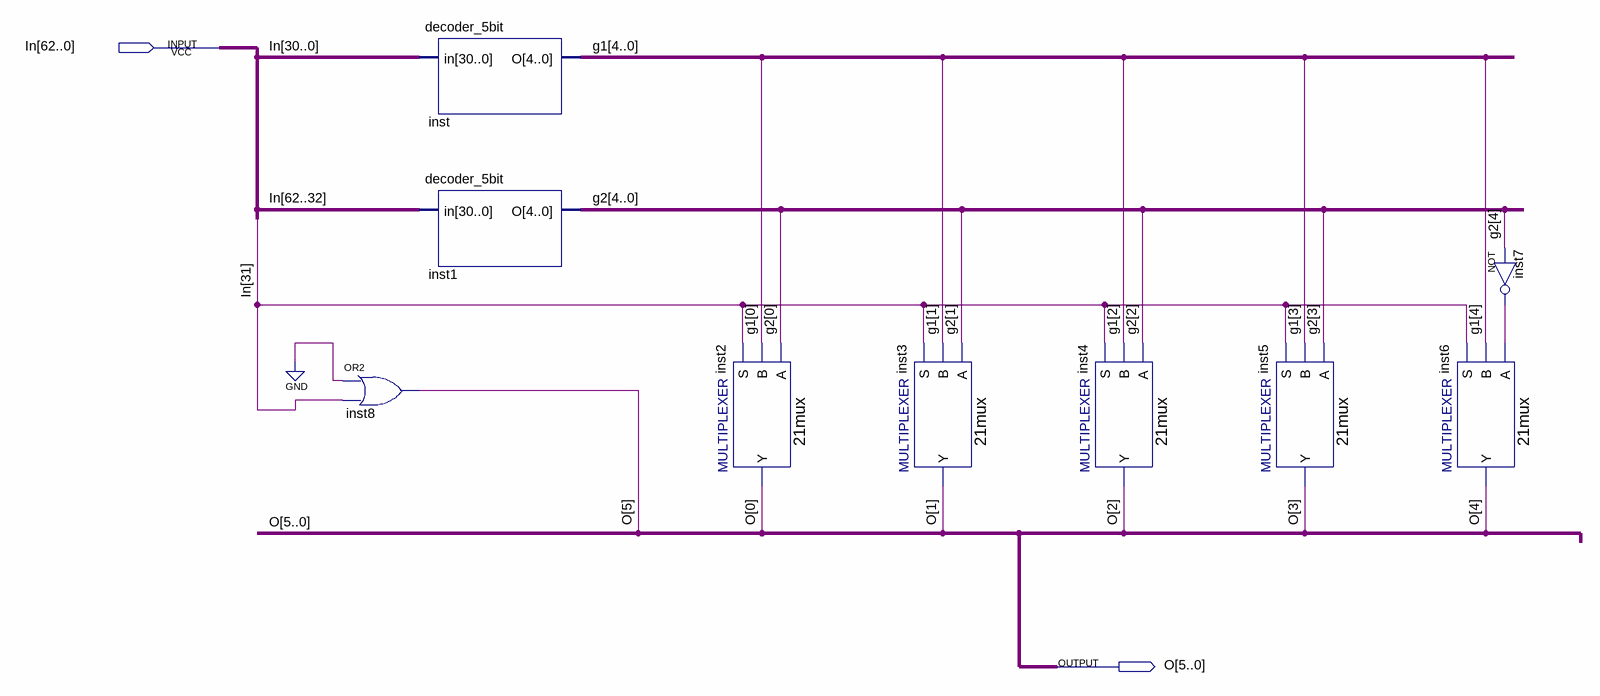
[diagram p0: schematic sheet]
// Quartus schematic decoder_6bit.bdf as structural Verilog: 9 symbols, 2 pins
module decoder_6bit (
  input  [62:0] In,
  output [5:0] O
);

  wire inst7_out;
  wire [4:0] g1, g2;

  or inst8 (O[5], 1'b0, In[31]);
  decoder_5bit inst (.in(In[30:0]), .O(g1));
  decoder_5bit inst1 (.in(In[62:32]), .O(g2));
  \21mux  inst2 (.S(In[31]), .B(g1[0]), .A(g2[0]), .Y(O[0]));
  \21mux  inst3 (.S(In[31]), .B(g1[1]), .A(g2[1]), .Y(O[1]));
  \21mux  inst4 (.S(In[31]), .B(g1[2]), .A(g2[2]), .Y(O[2]));
  \21mux  inst5 (.S(In[31]), .B(g1[3]), .A(g2[3]), .Y(O[3]));
  \21mux  inst6 (.S(In[31]), .B(g1[4]), .A(inst7_out), .Y(O[4]));
  not inst7 (inst7_out, g2[4]);
endmodule
